# Altium project RpiNeoCore_Display.PrjPcb (part 1 of 3)
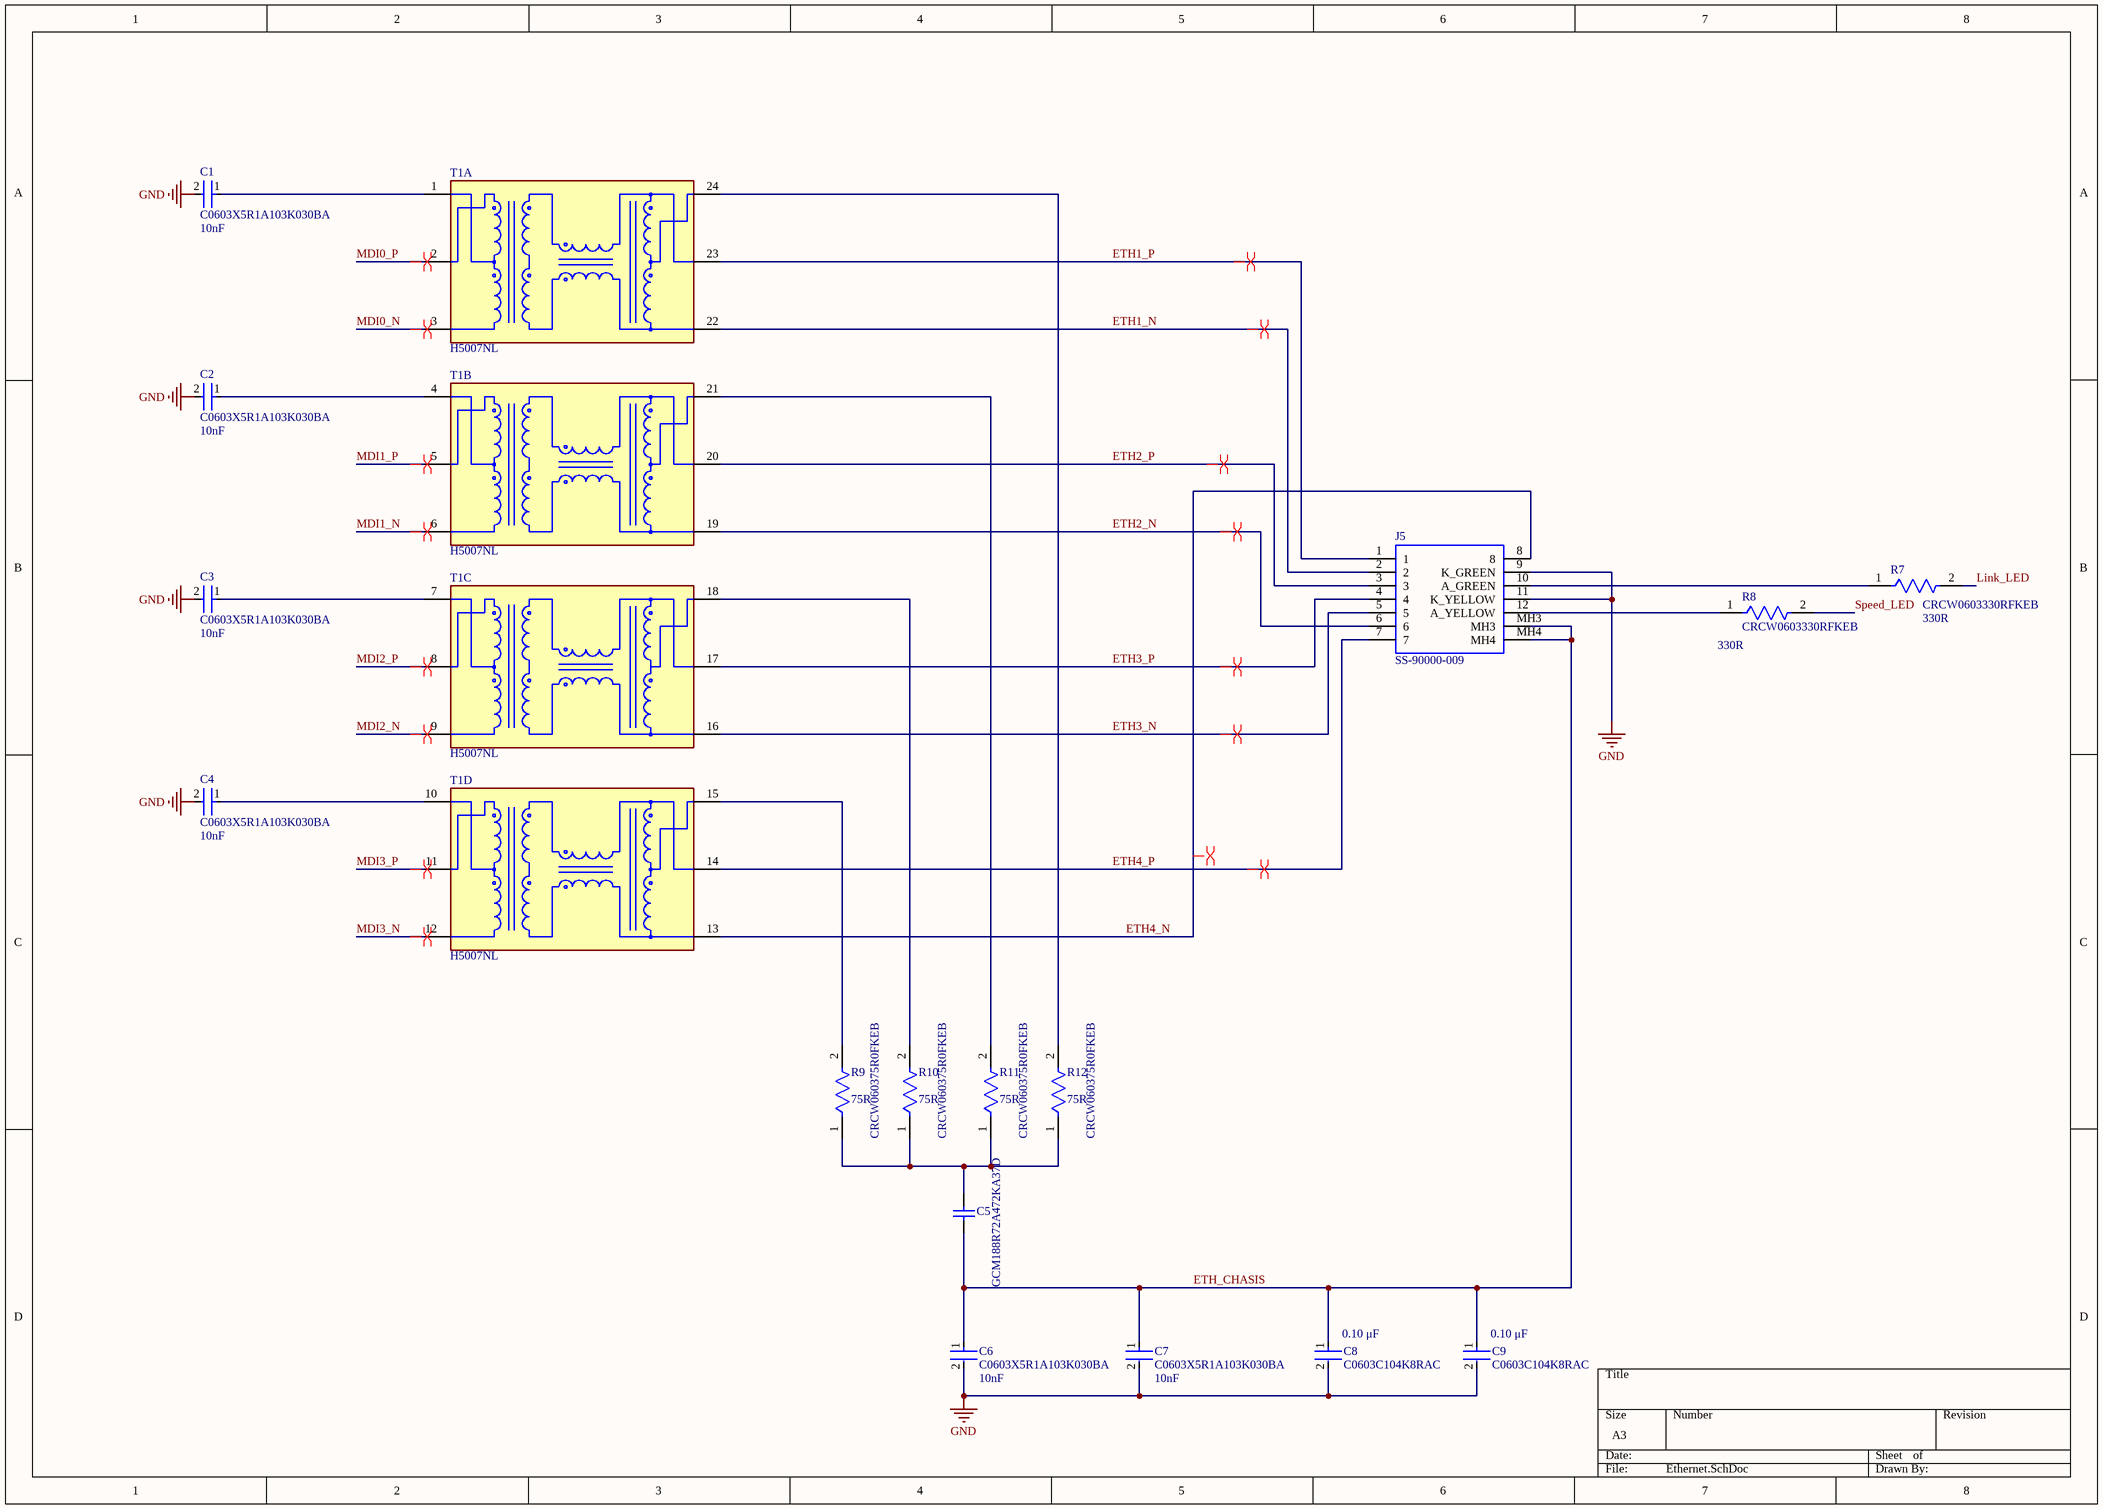
[diagram p0: Ethernet.SchDoc]
11 sheets, 210 parts. Net scope: global (net labels, ports and power ports of the same name join across sheets).
Board file: PCB1.PcbDoc
Sheets:
  Ethernet.SchDoc
  Sheet1.SchDoc
  Power.SchDoc
  DigitalInputs.SchDoc
  LED_DRIVER.SchDoc
  AlarmRelay.SchDoc
  AnalogInputs.SchDoc
  SerialCommunication.SchDoc
  SerialCommunication1.SchDoc
  SerialCommunication2.SchDoc
  CANBUS.SchDoc

## Sheet Ethernet.SchDoc
size A3; SheetNumber: 1; SheetTotal: 11

### Parts
C1  C0603X5R1A103K030BA  Capacitance: 10nF  [FP-C0603-030-0_03-MFG]
C2  C0603X5R1A103K030BA  Capacitance: 10nF  [FP-C0603-030-0_03-MFG]
C3  C0603X5R1A103K030BA  Capacitance: 10nF  [FP-C0603-030-0_03-MFG]
C4  C0603X5R1A103K030BA  Capacitance: 10nF  [FP-C0603-030-0_03-MFG]
C5  GCM188R72A472KA37D  [CAPC1608X90X35ML10T15]
C6  C0603X5R1A103K030BA  Capacitance: 10nF  [FP-C0603-030-0_03-MFG]
C7  C0603X5R1A103K030BA  Capacitance: 10nF  [FP-C0603-030-0_03-MFG]
C8  C0603C104K8RAC  Capacitance: 0.10 μF  [FP-C0603C-CF-MFG]
C9  C0603C104K8RAC  Capacitance: 0.10 μF  [FP-C0603C-CF-MFG]
J5  SS-90000-009  [SS90000009]
R7  CRCW0603330RFKEB  Resistance: 330R  [FP-CRCW0603-e3-IPC_A]
R8  CRCW0603330RFKEB  Resistance: 330R  [FP-CRCW0603-e3-IPC_A]
R9  CRCW060375R0FKEB  Resistance: 75R  [FP-CRCW0603-e3-IPC_B]
R10  CRCW060375R0FKEB  Resistance: 75R  [FP-CRCW0603-e3-IPC_B]
R11  CRCW060375R0FKEB  Resistance: 75R  [FP-CRCW0603-e3-IPC_B]
R12  CRCW060375R0FKEB  Resistance: 75R  [FP-CRCW0603-e3-IPC_B]
T1  H5007NL  [FP-H5007NL-MFG]  (parts A,B,C,D of 4)

### Nets
GND: C1.2 C2.2 C3.2 C4.2 C6.2 C7.2 C8.2 C9.2 J5.9(K_GREEN) J5.11(K_YELLOW)
ETH1_N: J5.2 T1.22(MX1-)
ETH1_P: J5.1 T1.23(MX1+)
ETH2_N: J5.6 T1.19(MX2-)
ETH2_P: J5.3 T1.20(MX2+)
ETH3_N: J5.5 T1.16(MX3-)
ETH3_P: J5.4 T1.17(MX3+)
ETH4_N: J5.8 T1.13(MX4-)
ETH4_P: J5.7 T1.14(MX4+)
ETH_CHASIS: C5.1 C6.1 C7.1 C8.1 C9.1 J5.MH3 J5.MH4
Link_LED: R7.2
MDI0_N: T1.3(TD1-)
MDI0_P: T1.2(TD1+)
MDI1_N: T1.6(TD2-)
MDI1_P: T1.5(TD2+)
MDI2_N: T1.9(TD3-)
MDI2_P: T1.8(TD3+)
MDI3_N: T1.12(TD4-)
MDI3_P: T1.11(TD4+)
Speed_LED: R8.2
NetC1_1: C1.1 T1.1(TCT1)
NetC2_1: C2.1 T1.4(TCT2)
NetC3_1: C3.1 T1.7(TCT3)
NetC4_1: C4.1 T1.10(TCT4)
NetC5_2: C5.2 R9.1 R10.1 R11.1 R12.1
NetJ5_10: J5.10(A_GREEN) R7.1
NetJ5_12: J5.12(A_YELLOW) R8.1
NetR9_2: R9.2 T1.15(MCT4)
NetR10_2: R10.2 T1.18(MCT3)
NetR11_2: R11.2 T1.21(MCT2)
NetR12_2: R12.2 T1.24(MCT1)

### Layout directives
differential pair: ETH1_N, ETH1_P, ETH2_N, ETH2_P, ETH3_N, ETH3_P, ETH4_N, ETH4_P, MDI0_N, MDI0_P, MDI1_N, MDI1_P, MDI2_N, MDI2_P, MDI3_N, MDI3_P

### Library data of the parts
C1-C4 C6 C7 = CMP-08246-002714-1: Multilayer Ceramic Capacitors 10nF ±10% 10V X5R SMD 0201; Dissipation Factor: 5%; Case Code (Imperial): 0201; Tolerance: 10%; Voltage: 10V; Case/Package: 0201; Width: 0.012inch; Series: C; Construction: Flat; Lead Free: Lead Free; Dielectric: X5R; Depth: 0.3mm; Mount: Surface Mount; Number of Pins: 2; Voltage Rating (DC): 10V; Radiation Hardening: No; Length: 0.6mm; Resistor Type: Ceramic; Dielectric Material: Ceramic; Packaging: Tape and Reel; Height: 0.3mm; Package Quantity: 1; RoHS Compliant: Yes; Thickness: 0.013inch; Min Operating Temperature: -55°C; Voltage Rating: 10V; Case Code (Metric): 0603; Weight: 6E-06oz; Max Operating Temperature: 85°C; Termination: SMD/SMT
C5 = CMP-2006-02966-1: Manufacturer: Murata; Part Number: GCM188R72A472KA37D
C8 C9 = CMP-03020-006081-2: C0603 0.10 μF X7R 30ppm/°C 10.00% 10 V; Manufacturer: KEMET; Value: 0.10 μF; Material: Ceramic; Automotive Grade: Grade 1; Voltage Rating: 10 V; Tolerance: 0.1; Automotive: Yes; Device Class L2: Capacitors; Height: 0.87mm; Temperature Range High: +125°C; Temperature Coefficient: 30ppm/°C; Temperature Range Low: -55°C; Package: C0603C-CF; Lead Free: Yes; Octopart: https://octopart.com/c0603c104k8rac-kemet-1325403; Manufacturer Part Number: C0603C104K8RAC; Temperature: -55°C to +125°C; Mouser Description: .1UF 10V 10% 0603; RoHS: TRUE; ComponentLink2URL: https://api.kemet.com/component-edge/download/datasheet/C0603C100J5GACAUTO.pdf; ComponentLink2Description: Datasheet; Temperature Characteristic: X7R; Device Class L1: Passive Components; Category: Cap; Device Class L3: Ceramic Capacitors
J5 = SS-90000-009: RJ45 8P8C Essential Jack; Manufacturer_Name: BelFuse; Geometry.Height: 13.38mm; Mouser Part Number: 530-SS-90000-009; Mouser Price/Stock: https://www.mouser.co.uk/ProductDetail/Stewart-Connector-Bel/SS-90000-009?qs=T%252BzbugeAwjge6q5Vl6EkRg%3D%3D; Manufacturer_Part_Number: SS-90000-009; Datasheet Link: https://www.belfuse.com/resources/drawings/stewartconnector/dr-STW-SS-90000-009.pdf
R7 R8 = CMP-2000-03240-2: RES Thick Film, 330Ω, 1%, 0.1W, 100ppm/°C, 0603; Voltage Rating (DC): 75V; Power Rating: 100mW; Case Code (Metric): 1608; Case/Package: 0603; Voltage Rating: 75V; Min Operating Temperature: -55°C; Tolerance: 1%; Temperature Coefficient: 100ppm/°C; Weight: 7.1E-05oz; Depth: 0.85mm; Package Quantity: 10000; Number of Terminations: 2; Width: 0.85mm; Radiation Hardening: No; Termination: SMD/SMT; Case Code (Imperial): 0603; Packaging: Tape and Reel; Lead Free: Lead Free; Max Power Dissipation: 100mW; Military Standard: Not; Height: 0.02inch; Max Operating Temperature: 155°C; Length: 1.55mm; Composition: Thick Film; Features: Automotive AEC-Q200; Contact Plating: Tin
R9-R12 = CMP-02407-007302-1: RES Thick Film, 75Ω, 1%, 0.1W, 100ppm/°C, 0603; Voltage Rating: 75V; Max Power Dissipation: 100mW; Min Operating Temperature: -55°C; Termination: SMD/SMT; Tolerance: 1%; Case Code (Metric): 1608; Width: 0.033inch; Package Quantity: 10000; Length: 0.061inch; Max Operating Temperature: 155°C; Height: 0.02inch; Number of Terminations: 2; Packaging: Tape and Reel; Case Code (Imperial): 0603; Features: Automotive AEC-Q200; Weight: 7.1E-05oz; Lead Free: Lead Free; Temperature Coefficient: 100ppm/°C; Composition: Thick Film; Power Rating: 100mW; Case/Package: 0603
T1 = CMP-2000-06385-2: MODULE SINGLE GIGABIT LAN 24SOIC; Isolation Voltage: 1.5kV; Insertion Loss: 1dB; Return Loss: -10dB; Turns Ratio: 1:1; Lead/Base Style: Gull Wing; Shielding: Unshielded; Packaging: Rail/Tube; Weight: 0.056438oz; Depth: 16mm; Mount: Surface Mount; Number of Pins: 24; Lead Free: Lead Free; Min Operating Temperature: 0°C; Length: 17.53mm; Package Quantity: 25; Case/Package: Module; Radiation Hardening: No; RoHS Compliant: Yes; Max Operating Temperature: 70°C; Series: -; Width: 12.2mm; Height: 5.51mm; Termination: SMD/SMT; Height - Seated (Max): 5.76mm

## Sheet Sheet1.SchDoc
size 381 x 241 mm; SheetNumber: 2; SheetTotal: 11
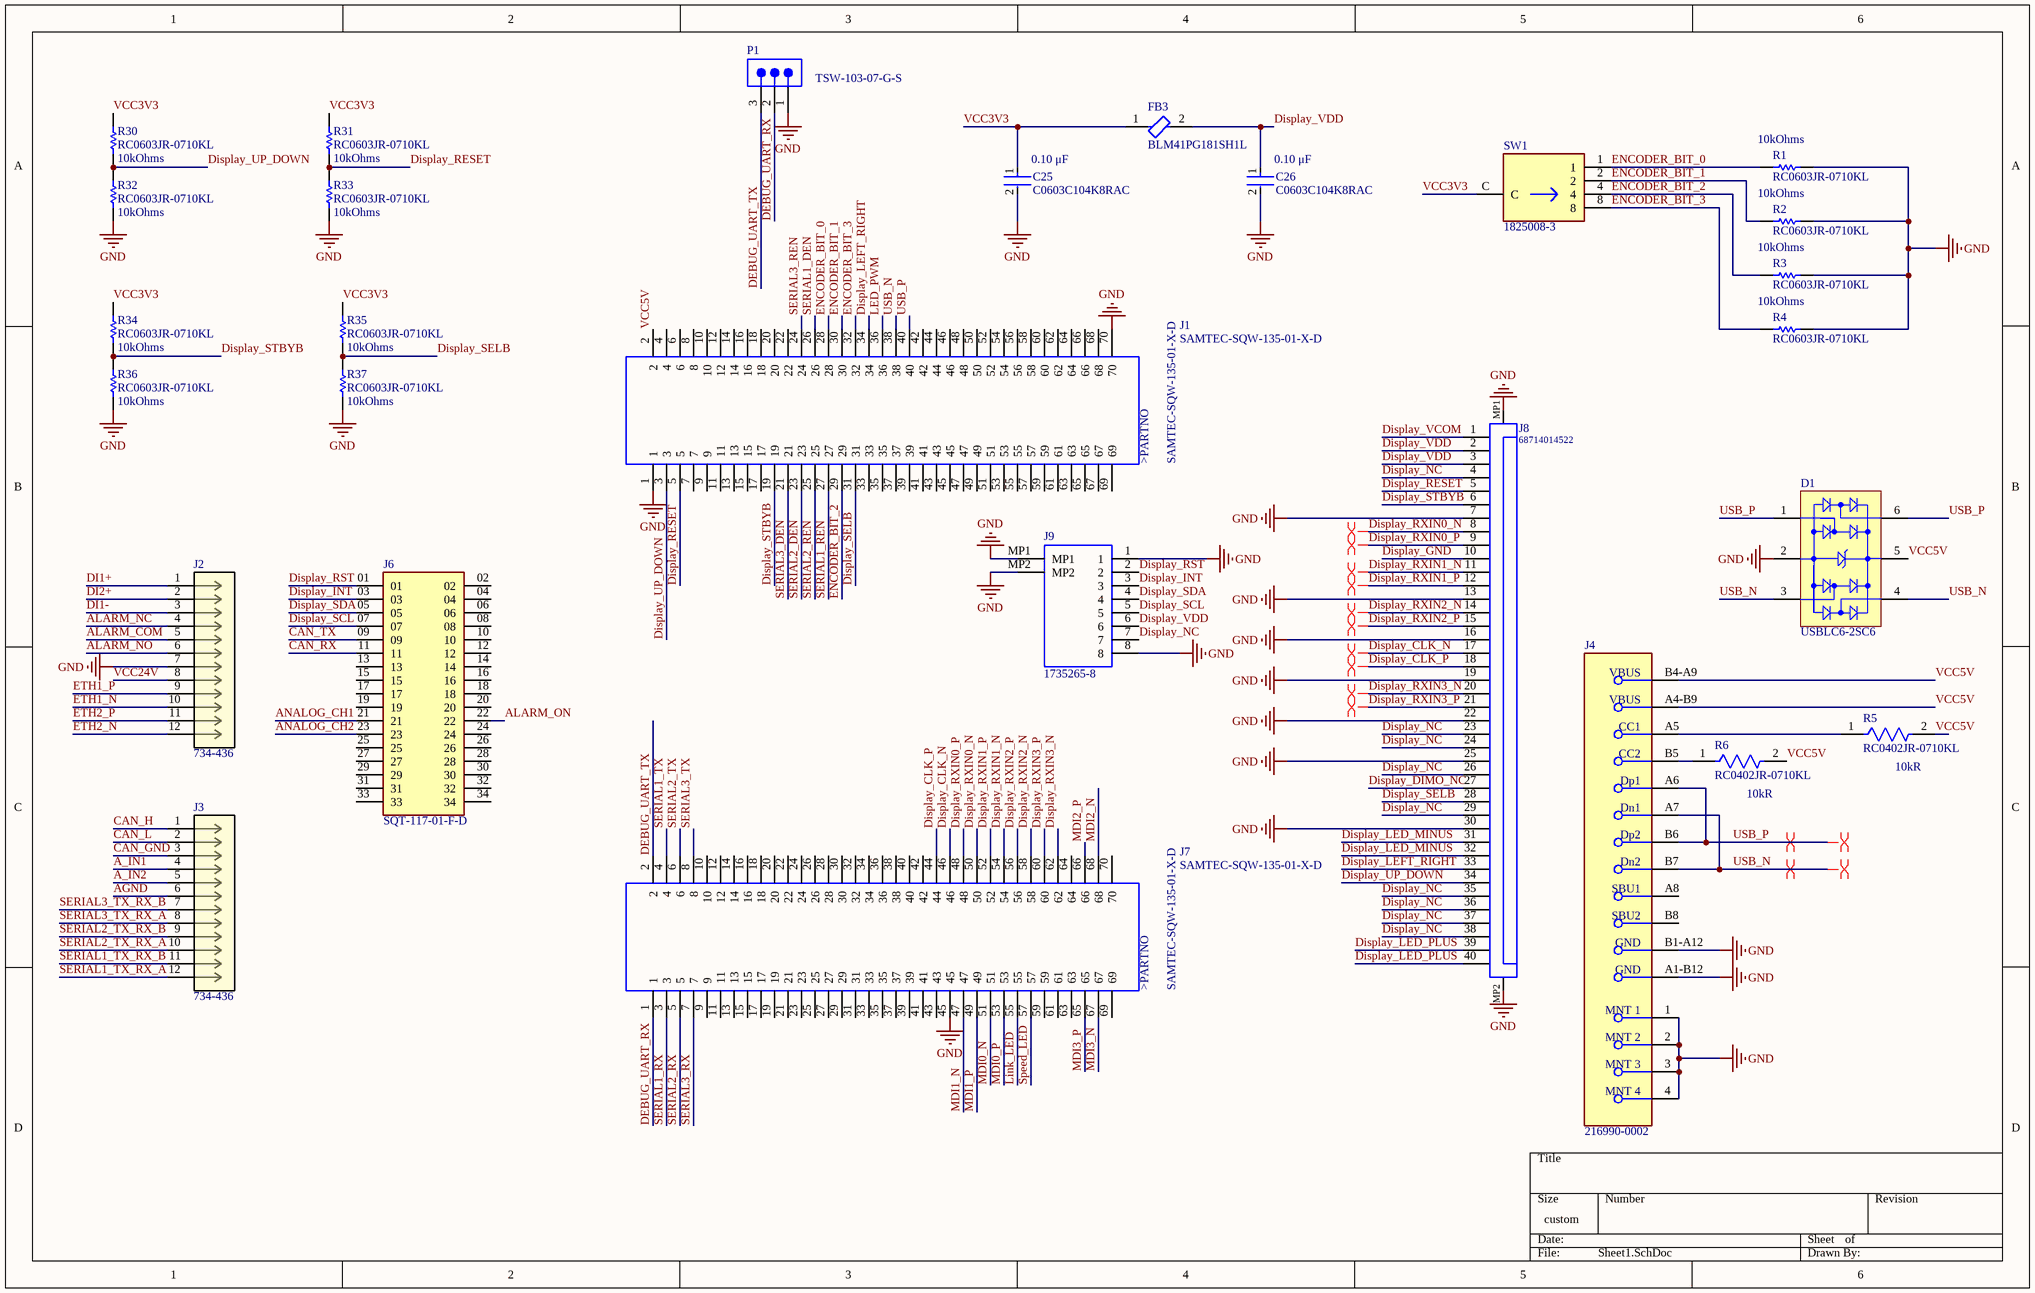
[diagram p1: Sheet1.SchDoc]

### Parts
C25  C0603C104K8RAC  Capacitance: 0.10 μF  [FP-C0603C-CF-MFG]
C26  C0603C104K8RAC  Capacitance: 0.10 μF  [FP-C0603C-CF-MFG]
D1  USBLC6-2SC6  [STM-SOT23-6L_V]
FB3  BLM41PG181SH1L  [FP-BLM41-0_2-a1_2-MFG]
J1  SAMTEC-SQW-135-01-X-D  [SAMTEC-SQW-135-01-X-D]
J2  734-436  [CONN12_734-436_WAG]
J3  734-436  [CONN12_734-436_WAG]
J4  216990-0002  [FP-216990-0002-MFG]
J6  SQT-117-01-F-D  [SAMTEC_SQT-117-01-F-D]
J7  SAMTEC-SQW-135-01-X-D  [SAMTEC-SQW-135-01-X-D]
J8  68714014522  [68714014522]
J9  1735265-8  [17352658]
P1  TSW-103-07-G-S  [SMTC-TSW-103-07-X-S]
R1  RC0603JR-0710KL  Resistance: 10kOhms  [RESC1608X55X25ML10T15]
R2  RC0603JR-0710KL  Resistance: 10kOhms  [RESC1608X55X25ML10T15]
R3  RC0603JR-0710KL  Resistance: 10kOhms  [RESC1608X55X25ML10T15]
R4  RC0603JR-0710KL  Resistance: 10kOhms  [RESC1608X55X25ML10T15]
R5  RC0402JR-0710KL  Resistance: 10kR  [FP-RC0402-0_4-IPC_C]
R6  RC0402JR-0710KL  Resistance: 10kR  [FP-RC0402-0_4-IPC_C]
R30  RC0603JR-0710KL  Resistance: 10kOhms  [RESC1608X55X25ML10T15]
R31  RC0603JR-0710KL  Resistance: 10kOhms  [RESC1608X55X25ML10T15]
R32  RC0603JR-0710KL  Resistance: 10kOhms  [RESC1608X55X25ML10T15]
R33  RC0603JR-0710KL  Resistance: 10kOhms  [RESC1608X55X25ML10T15]
R34  RC0603JR-0710KL  Resistance: 10kOhms  [RESC1608X55X25ML10T15]
R35  RC0603JR-0710KL  Resistance: 10kOhms  [RESC1608X55X25ML10T15]
R36  RC0603JR-0710KL  Resistance: 10kOhms  [RESC1608X55X25ML10T15]
R37  RC0603JR-0710KL  Resistance: 10kOhms  [RESC1608X55X25ML10T15]
SW1  1825008-3  [FP-1825008-3-MFG]

### Nets
GND: C25.2 C26.2 D1.2(GND) J1.1 J1.70 J2.7 J4.1(MNT_1) J4.2(MNT_2) J4.3(MNT_3) J4.4(MNT_4) J4.A1-B12(GND) J4.B1-A12(GND) J7.45 J8.7 J8.13 J8.16 J8.19 J8.22 J8.25 J8.30 J8.MP1 J8.MP2 J9.1 J9.8 J9.MP1 J9.MP2 P1.1 R1.2 R2.2 R3.2 R4.2 R32.1 R33.1 R36.1 R37.1
A_IN1: J3.4
A_IN2: J3.5
AGND: J3.6
ALARM_COM: J2.5
ALARM_NC: J2.4
ALARM_NO: J2.6
ALARM_ON: J6.22
ANALOG_CH1: J6.21
ANALOG_CH2: J6.23
CAN_GND: J3.3
CAN_H: J3.1
CAN_L: J3.2
CAN_RX: J6.11
CAN_TX: J6.09
DEBUG_UART_RX: J7.1 P1.2
DEBUG_UART_TX: J7.2 P1.3
DI1+: J2.1
DI1-: J2.3
DI2+: J2.2
Display_CLK_N: J7.46 J8.17
Display_CLK_P: J7.44 J8.18
Display_DIMO_NC: J8.27
Display_GND: J8.10
Display_INT: J6.03 J9.3
Display_LED_MINUS: J8.31 J8.32
Display_LED_PLUS: J8.39 J8.40
Display_LEFT_RIGHT: J1.34 J8.33
Display_NC: J8.4 J8.23 J8.24 J8.26 J8.29 J8.35 J8.36 J8.37 J8.38 J9.7
Display_RESET: J1.5 J8.5 R31.1 R33.2
Display_RST: J6.01 J9.2
Display_RXIN0_N: J7.50 J8.8
Display_RXIN0_P: J7.48 J8.9
Display_RXIN1_N: J7.54 J8.11
Display_RXIN1_P: J7.52 J8.12
Display_RXIN2_N: J7.58 J8.14
Display_RXIN2_P: J7.56 J8.15
Display_RXIN3_N: J7.62 J8.20
Display_RXIN3_P: J7.60 J8.21
Display_SCL: J6.07 J9.5
Display_SDA: J6.05 J9.4
Display_SELB: J1.31 J8.28 R35.1 R37.2
Display_STBYB: J1.19 J8.6 R34.1 R36.2
Display_UP_DOWN: J1.3 J8.34 R30.1 R32.2
Display_VCOM: J8.1
Display_VDD: C26.1 FB3.2 J8.2 J8.3 J9.6
ENCODER_BIT_0: J1.28 R1.1 SW1.1
ENCODER_BIT_1: J1.30 R2.1 SW1.2
ENCODER_BIT_2: J1.29 R3.1 SW1.4
ENCODER_BIT_3: J1.32 R4.1 SW1.8
ETH1_N: J2.10
ETH1_P: J2.9
ETH2_N: J2.12
ETH2_P: J2.11
LED_PWM: J1.36
Link_LED: J7.55
MDI0_N: J7.51
MDI0_P: J7.53
MDI1_N: J7.47
MDI1_P: J7.49
MDI2_N: J7.68
MDI2_P: J7.66
MDI3_N: J7.67
MDI3_P: J7.65
SERIAL1_DEN: J1.26
SERIAL1_REN: J1.27
SERIAL1_RX: J7.3
SERIAL1_TX: J7.4
SERIAL1_TX_RX_A: J3.12
SERIAL1_TX_RX_B: J3.11
SERIAL2_DEN: J1.23
SERIAL2_REN: J1.25
SERIAL2_RX: J7.5
SERIAL2_TX: J7.6
SERIAL2_TX_RX_A: J3.10
SERIAL2_TX_RX_B: J3.9
SERIAL3_DEN: J1.21
SERIAL3_REN: J1.24
SERIAL3_RX: J7.7
SERIAL3_TX: J7.8
SERIAL3_TX_RX_A: J3.8
SERIAL3_TX_RX_B: J3.7
Speed_LED: J7.57
USB_N: D1.3(I/O_2) D1.4(I/O_3) J1.38 J4.A7(Dn1) J4.B7(Dn2)
USB_P: D1.1(I/O_1) D1.6(I/O_4) J1.40 J4.A6(Dp1) J4.B6(Dp2)
VCC3V3: C25.1 FB3.1 R30.2 R31.2 R34.2 R35.2 SW1.C
VCC5V: D1.5(VBUS) J1.2 J4.A4-B9(VBUS) J4.B4-A9(VBUS) R5.2 R6.2
VCC24V: J2.8
NetJ4_A5: J4.A5(CC1) R5.1
NetJ4_B5: J4.B5(CC2) R6.1

Not connected (* = marked no-connect by the designer): J1 4 6 7 8 9 10 11 12 13 14 15 16 17 18 20 22 33 35 37 39 41 42 43 44 45 46 47 48 49 50 51 52 53 54 55 56 57 58 59 60 61 62 63 64 65 66 67 68 69; J4 A8(SBU1) B8(SBU2); J6 02 04 06 08 10 12 13 14 15 16 17 18 19 20 24 25 26 27 28 29 30 31 32 33 34; J7 9 10 11 12 13 14 15 16 17 18 19 20 21 22 23 24 25 26 27 28 29 30 31 32 33 34 35 36 37 38 39 40 41 42 43 59 61 63 64 69 70

### Layout directives
differential pair: Display_CLK_N, Display_CLK_P, Display_RXIN0_N, Display_RXIN0_P, Display_RXIN1_N, Display_RXIN1_P, Display_RXIN2_N, Display_RXIN2_P, Display_RXIN3_N, Display_RXIN3_P, USB_N, USB_P
net class diff90: USB_N, USB_P
net class diff120: Display_CLK_N, Display_CLK_P, Display_RXIN0_N, Display_RXIN0_P, Display_RXIN1_N, Display_RXIN1_P, Display_RXIN2_N, Display_RXIN2_P, Display_RXIN3_N, Display_RXIN3_P

### Notes on the sheet
- (in symbol SAMTEC-SQW-135-01-X-D) >PARTNO

### Library data of the parts
C25 C26 = CMP-03020-006081-2: as C8 on sheet Ethernet; Automotive: Yes; Device Class L2: Capacitors; Height: 0.87mm; Temperature Range High: +125°C; Temperature Coefficient: 30ppm/°C; Temperature Range Low: -55°C; Package: C0603C-CF; Lead Free: Yes; Octopart: https://octopart.com/c0603c104k8rac-kemet-1325403; Manufacturer Part Number: C0603C104K8RAC; Temperature: -55°C to +125°C; Mouser Description: .1UF 10V 10% 0603; RoHS: TRUE; ComponentLink2URL: https://api.kemet.com/component-edge/download/datasheet/C0603C100J5GACAUTO.pdf; ComponentLink2Description: Datasheet; Temperature Characteristic: X7R; Device Class L1: Passive Components; Category: Cap; Device Class L3: Ceramic Capacitors
D1 = CMP-2000-05378-1: Very low capacitance ESD protection, 3.5 pF, -40 to 125 degC, 6-Pin SOT23, RoHS, Tape and Reel; Manufacturer: STMicroelectronics; Polarity: Uni-Directional; Clamping Voltage: 17V; Rad Hardened: No; Product Height (mm): 1.3mm; Leakage Current (Max): 0.15uA; Product Length (mm): 3.05mm; Number of Elements: 1; Peak Pulse Current: 5A; Configuration: Dual; Reverse Breakdown Voltage: 6V; Working Voltage (Max): 5V; Capacitance Value: 3.5pF; Suppressor Type: DiodeArrays; Product Depth (mm): 1.75mm; Test Current (It): 1mA; Package / Case: SOT-23; Operating Temperature Max Deg. C: 125C; Package Description: 6-Pin Small Outline Transistor, Body 2.925 x 1.625 mm, Pitch 0.95 mm; Package Reference: SOT23-6L; Datasheet Version: Rev. 5, 10/2011; Operating Temperature Min Deg. C: -40C; Mounting Style: SurfaceMount; Direction Type: Uni-Directional; Mounting: SurfaceMount; Pin Count: 6; Leakage Current: 0.15uA; Packaging: TapeandReel; Operating Temperature Classification: Automotive; Clamping Voltage (Max): 17V; Manufacturer URL: http://www.st.com/; Reverse Stand-off Voltage: 5V; Datasheet URL: http://www.st.com/st-web-ui/static/active/en/resource/technical/document/datasheet/CD00050750.pdf; Working Voltage: 5V; Operating Temp Range: -40Cto125C
FB3 = CMP-06046-002023-1: Ferrite Bead, 1806, 180Ω @ 100MHz, 25%, 0.02Ω, 3.5A; Impedance: 180R; Number of Lines: 1; Max DC Current: 50mA; DC Resistance (DCR): 20mR; Mount: Surface Mount; Length: 4.5mm; Tolerance: 25%; Series: EMIFIL®, BLM41P; Package Quantity: 2500; Min Operating Temperature: -55°C; Max Operating Temperature: 125°C; Height: 0.071inch; Packaging: Tape and Reel; Contact Plating: Tin; Test Frequency: 100MHz; Ratings: AEC-Q200; Case Code (Metric): 4516; Termination: SMD/SMT; Case Code (Imperial): 1806; Width: 0.063inch; Max Current Rating: 3.5A; Case/Package: 1806
J2 J3 = 734-436: No Description Available; Mfr_Name: Wago; Copyright: Copyright (C) 2022 Ultra Librarian. All rights reserved.; Manufacturer_Part_Number: 734-436; RefDes: RefDes; Type: DEV
J4 = CMP-04767-000018-1: CONN RCP USB2.0 TYP C 24P SMD RA
J6 = SQT-117-01-F-D: MF: Samtec; Package: None; Value: *; Price: None; MP: SQT-117-01-F-D; Availability: Unavailable
J8 = CMP-1502-01545-1: SMT ZIF Connectors WR-FPC, Horizontal, Bottom Contact, pitch 0.5 mm, 40 pins; Manufacturer: Wurth Elektronik; Pitch: 0.5mm; Contact Resistance: 20mOhm; Working Voltage: 50VAC; Rated Current: 0.5A; Withstanding Voltage: 250VAC; Pin Number: 40; Part Number: 68714014522; Package Reference: 68714014522; Manufacturer URL: http://www.we-online.de; Operating Temperature: -25to85degC; Publisher: WurthElektronik; Datasheet URL: https://katalog.we-online.de/em/datasheet/68714014522.pdf; Packaging: TapeandReel; Contact Design: BottomContact; Orientation: Horizontal; Mounting Technology: SMT
J9 = 1735265-8: 1MM FPC HORZ.BOTTOM CONT.ASSY 8P (Au); Manufacturer_Name: TE Connectivity; Geometry.Height: 2.74mm; Mouser Part Number: 571-1735265-8; Mouser Price/Stock: https://www.mouser.co.uk/ProductDetail/TE-Connectivity-AMP/1735265-8?qs=vkMqrgFpRajjm%252BbPDw7SSA%3D%3D; Manufacturer_Part_Number: 1735265-8; Datasheet Link: https://www.te.com/commerce/DocumentDelivery/DDEController?Action=showdoc&DocId=Customer+Drawing%7F1735265%7FB%7Ftif%7FEnglish%7FENG_CD_1735265_B.tif%7F1735265-8
P1 = CMP-1024-00333-1: 0.025" SQ Post Header, Through-hole, Vertical, -55 to 125 degC, 2.54 mm Pitch, 3-Pin, Male, RoHS; Manufacturer: Samtec; Pitch: 2.54 mm; ComponentLink3URL: http://www.samtec.com/documents/webfiles/cpdf/TSW-XXX-XX-XXX-X-XX-XXX-MKT.pdf; Temperature Range: -55 to 125 degC; DatasheetVersion: F-214; ComponentLink1Description: Manufacturer URL; ComponentLink2URL: http://www.samtec.com/documents/webfiles/pdf/TSW_TH.PDF; RoHS: True; Orientation: Vertical; ComponentLink2Description: Datasheet; ComponentLink3Description: Package Specification; PackageDescription: .025[0.64] SQ. Post Terminal Strip Assembly; Mounting Technology: Through-hole; PackageVersion: DM, 8/1988; ComponentLink1URL: http://www.samtec.com; PackageReference: TSW-103-07-X-S; PartNumber: TSW-103-07-G-S
R1-R4 R30-R37 = CMP-2000-05022-1: Resistor, 10 KOhm, +/- 5%, 100 mW, -55 to 155 degC, 0603 (1608 Metric), RoHS, Tape and Reel; Manufacturer: Yageo; Voltage Rating: 50V; Temperature Coefficient: 100PPM/C; Power Rating: 100mW; Package Reference: 603; Series: RC; Case Code - mm: 1608; Packaging: Reel; Datasheet URL: http://www.farnell.com/datasheets/443971.pdf; Datasheet Version: Rev. 4, 04/2009; Operating Temperature Range: -55Cto+155C; Product: ThickFilmResistorsGeneralPurpose; Package Description: 2-Pin Surface Mount Device, Body 1.6 x 0.8 mm; Manufacturer URL: http://www.yageo.com/; Case Code - in: 0603; Tolerance: 5%; Termination Style: SMD/SMT
R5 R6 = CMP-2002-07915-3: RES 10K OHM 5% 1/16W 0402; Max Power Dissipation: 63mW; Temperature Coefficient: 100ppm/°C; Power Rating: 62.5mW; Voltage Rating: 50V; Size Code: 0402; Resistance Tolerance: 5%; Packaging: Tape and Reel; Case Code (Metric): 1005; Lead Free: Lead Free; Resistor Type: Thick Film; Min Operating Temperature: -55°C; Military Standard: Not; Depth: 0.5mm; Series: RC; Case/Package: 0402; Construction: Rectangular; Number of Terminations: 2; Package Quantity: 1; Termination: SMD/SMT; Length: 0.039inch; Case Code (Imperial): 0402; Height: 0.016inch; Features: Moisture Resistant; RoHS Compliant: Yes; Max Operating Temperature: 155°C; Tolerance: 5%; Width: 0.02inch
SW1 = CMP-03404-000004-1: SW ROTARY DIP HEX COMP 0.4VA 20V; Sealable: No (Without); Washable: Yes; Number of Positions: 16; Illumination Type: Illuminated; Pitch: 2.54mm; Throw Configuration: SP16T; Series: DRD, Alcoswitch; Voltage Rating (AC): 20V; Housing Material: Thermoplastic; Max Operating Temperature: 85°C; Contact Plating: Gold; ELV: Compliant; Package Quantity: 45; Flammability Rating: UL94 V-0; Radiation Hardening: No; Voltage Rating (DC): 20V; Contact Material: Copper Alloy; Packaging: Rail/Tube; Depth: 12mm; Min Operating Temperature: -30°C; Max Voltage Rating (AC): 20V; Housing Color: Black; Length: 10mm; Mount: Through Hole; Lead Free: Lead Free; Actuator Type: Rotary; RoHS Compliant: Yes; Type: Switch; Max Voltage Rating (DC): 20V; Orientation: Right Angle; Termination: PC Pins
J1 J7 = SAMTEC-SQW-135-01-X-D: Package: None; Price: None; Value: *; MP: SAMTEC-SQW-135-01-X-D; Availability: Unavailable

## Sheet Power.SchDoc
size A3; SheetNumber: 3; SheetTotal: 11
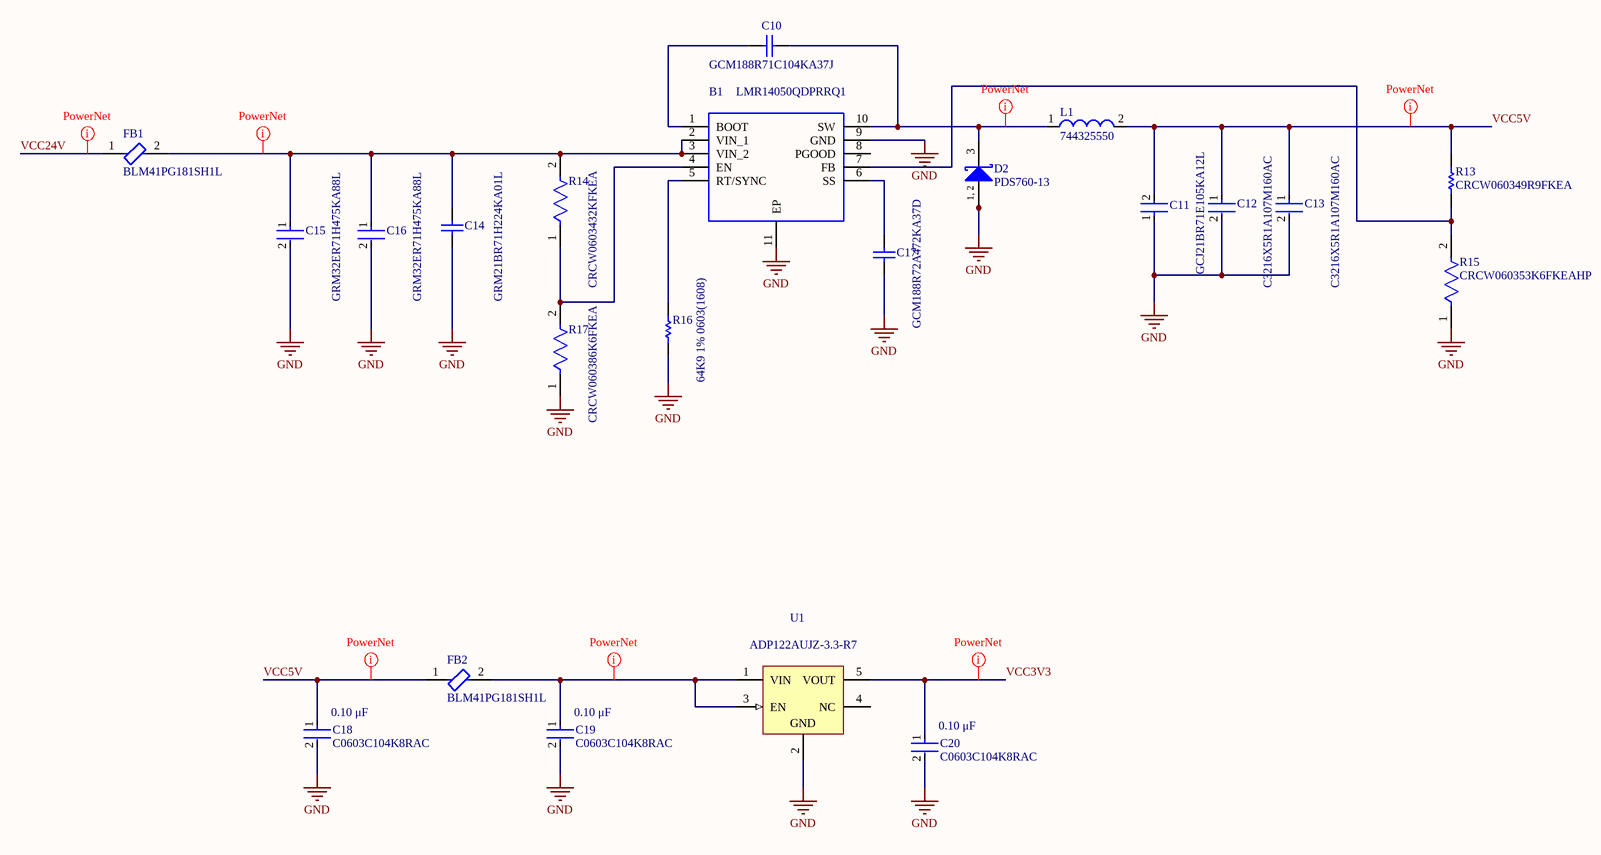
[diagram p2: Power.SchDoc]

### Parts
B1  LMR14050QDPRRQ1  [SON80P400X400X80-11N]
C10  GCM188R71C104KA37J  [CAPC1608X90X35LL10T15]
C11  GCJ21BR71E105KA12L  [FP-GCJ21B-0_3-MFG]
C12  C3216X5R1A107M160AC  [FP-C3216-160-0_3-IPC_C]
C13  C3216X5R1A107M160AC  [FP-C3216-160-0_3-IPC_C]
C14  GRM21BR71H224KA01L  [CAPC2013X135X45NL10T25]
C15  GRM32ER71H475KA88L  [FP-GRM32-MFG]
C16  GRM32ER71H475KA88L  [FP-GRM32-MFG]
C17  GCM188R72A472KA37D  [CAPC1608X90X35ML10T15]
C18  C0603C104K8RAC  Capacitance: 0.10 μF  [FP-C0603C-CF-MFG]
C19  C0603C104K8RAC  Capacitance: 0.10 μF  [FP-C0603C-CF-MFG]
C20  C0603C104K8RAC  Capacitance: 0.10 μF  [FP-C0603C-CF-MFG]
D2  PDS760-13  [DIOD-POWERDI5-3_V]
FB1  BLM41PG181SH1L  [FP-BLM41-0_2-a1_2-MFG]
FB2  BLM41PG181SH1L  [FP-BLM41-0_2-a1_2-MFG]
L1  744325550  [WE-HCI-1050]
R13  CRCW060349R9FKEA  [RESC1609X50X30ML10T20]
R14  CRCW0603432KFKEA  [FP-CRCW0603-e3-MFG]
R15  CRCW060353K6FKEAHP  [FP-CRCW0603-HPe3-MFG]
R16  64K9 1% 0603(1608)  [RESC0603(1608)_N]
R17  CRCW060386K6FKEA  [FP-CRCW0603-e3-IPC_B]
U1  ADP122AUJZ-3.3-R7  [ADI-UJ-5_M]

### Nets
GND: B1.9(GND) B1.11(EP) C11.1 C12.2 C13.2 C14.1 C15.2 C16.2 C17.1 C18.2 C19.2 C20.2 D2.1(A) D2.2(A) R15.1 R16.1 R17.1 U1.2(GND)
VCC3V3: C20.1 U1.5(VOUT)
VCC5V: C11.2 C12.1 C13.1 C18.1 FB2.1 L1.2 R13.2
VCC24V: FB1.1
NetB1_1: B1.1(BOOT) C10.1
NetB1_2: B1.2(VIN_1) B1.3(VIN_2) C14.2 C15.1 C16.1 FB1.2 R14.2
NetB1_4: B1.4(EN) R14.1 R17.2
NetB1_5: B1.5(RT/SYNC) R16.2
NetB1_6: B1.6(SS) C17.2
NetB1_7: B1.7(FB) R13.1 R15.2
NetB1_10: B1.10(SW) C10.2 D2.3(K) L1.1
NetC19_1: C19.1 FB2.2 U1.1(VIN) U1.3(EN)

Not connected (* = marked no-connect by the designer): B1 8(PGOOD); U1 4(NC)

### Layout directives
net class Power: NetB1_2, NetB1_10, NetC19_1, VCC3V3, VCC5V, VCC24V

### Notes on the sheet
- (in symbol CMP-2000-07476-1) 1, 2

### Library data of the parts
B1 = LMR14050QDPRRQ1: Automotive 40V, 5A SIMPLE SWITCHER&#174;, 2.2MHz Step-Down Regulator with 40uA IQ; Manufacturer_Name: Texas Instruments; Geometry.Height: 0.8mm; Mouser Part Number: 595-LMR14050QDPRRQ1; Mouser Price/Stock: https://www.mouser.co.uk/ProductDetail/Texas-Instruments/LMR14050QDPRRQ1?qs=osPbIpHqQ9V%2F1b1tDugQKw%3D%3D; Manufacturer_Part_Number: LMR14050QDPRRQ1; Datasheet Link: http://www.ti.com/lit/gpn/lmr14050-q1
C10 = CMP-2006-02356-1: Manufacturer: Murata; Part Number: GCM188R71C104KA37J
C11 = CMP-2007-03211-2: Multilayer Ceramic Capacitors MLCC - SMD/SMT 0805 1uF 10%, 25VDC,  X7R 15%; Voltage Rating (DC): 25V; Package Quantity: 3000; Depth: 1.25mm; Packaging: Tape and Reel; Voltage Rating: 25V; Max Operating Temperature: 125°C; Ratings: AEC-Q200; Width: 1.25mm; Min Operating Temperature: -55°C; Termination: SMD/SMT; Lead Free: Lead Free; Dielectric: X7R; Length: 2mm; Thickness: 0.057inch; Capacitance: 1uF; Tolerance: 10%; Case Code (Metric): 2012; Case/Package: 0805; Mount: Surface Mount; Features: Soft Termination; Case Code (Imperial): 0805
C12 C13 = CMP-2000-05396-3: Multilayer Ceramic Capacitors 100uF ±20% 10V X5R SMD 1206; Voltage Rating (DC): 10V; Length: 3.2mm; Mount: Surface Mount; Depth: 1.6mm; Width: 1.6mm; Package Quantity: 1; Min Operating Temperature: -55°C; Packaging: Tape and Reel; Max Operating Temperature: 85°C; Dielectric: X5R; Construction: Flat; Case Code (Imperial): 1206; Capacitance: 100uF; Thickness: 0.075inch; Radiation Hardening: No; RoHS Compliant: Yes; Series: C; Dielectric Material: Ceramic; Voltage: 10V; REACH SVHC: No SVHC; Case Code (Metric): 3216; Weight: 0.000571oz; Height: 1.6mm; Voltage Rating: 10V; Termination: SMD/SMT; Lead Free: Lead Free; Tolerance: 20%; Case/Package: 1206; Resistor Type: Ceramic
C14 = CMP-2007-03583-1: Manufacturer: Murata; Part Number: GRM21BR71H224KA01L
C15 C16 = CMP-1038-02162-3: CAP CER 4.7UF 50V X7R 1210; Manufacturer: Murata; Tolerance: 10%; Temperature Coefficient: 15%; Material: Ceramic; Lead Free: Yes; Value: 4.7uF; ComponentLink2Description: Datasheet; Capacitance: 4.7uF; Digikey Description: CAP CER 4.7UF 50V X7R 1210; Category: Cap; Automotive: No; ComponentLink2URL: https://search.murata.co.jp/Ceramy/image/img/A01X/G101/ENG/GRM32ER71H475KA88-01A.pdf; Package: GRM32; Device Class L2: Capacitors; Voltage Rating: 50V; Device Class L1: Passive Components; Mouser Description: Capacitor Capacitance tolerance: ±10% Ceramic type: X7R Construction form: 1210 Capacitance: 4.7 µF Rated voltage: 50...; Octopart: https://octopart.com/grm32er71h475ka88l-murata-196576; Temperature: -55°C to +125°C; Temperature Range Low: -55°C; Height: 2.7mm; Manufacturer Part Number: GRM32ER71H475KA88L; Temperature Characteristic: X7R; Temperature Range High: +125°C; RoHS: TRUE; Device Class L3: Ceramic Capacitors
C17 = CMP-2006-02966-1: Manufacturer: Murata; Part Number: GCM188R72A472KA37D
C18-C20 = CMP-03020-006081-2: as C8 on sheet Ethernet; Automotive: Yes; Device Class L2: Capacitors; Height: 0.87mm; Temperature Range High: +125°C; Temperature Coefficient: 30ppm/°C; Temperature Range Low: -55°C; Package: C0603C-CF; Lead Free: Yes; Octopart: https://octopart.com/c0603c104k8rac-kemet-1325403; Manufacturer Part Number: C0603C104K8RAC; Temperature: -55°C to +125°C; Mouser Description: .1UF 10V 10% 0603; RoHS: TRUE; ComponentLink2URL: https://api.kemet.com/component-edge/download/datasheet/C0603C100J5GACAUTO.pdf; ComponentLink2Description: Datasheet; Temperature Characteristic: X7R; Device Class L1: Passive Components; Category: Cap; Device Class L3: Ceramic Capacitors
D2 = CMP-2000-07476-1: Schottky Barrier Rectifier, 60 V, 7 A, -65 to 150 degC, 3-Pin SMD, RoHS, Tape and Reel; Manufacturer: Diodes Inc; Max Repetitive Reverse Voltage (Vrrm): 60V; Element Configuration: CommonAnode; Max Forward Surge Current (Ifsm): 275A; Polarity: Standard; Forward Voltage: 620mV; Forward Current: 7A; Peak Reverse Current: 200uA; Case\/Package: SMD/SMT; Manufacturer URL: http://www.diodes.com/; Reverse Voltage (DC): 60V; Lead Free: LeadFree; Voltage Rating (DC): 60V; Min Operating Temperature: -65degC; Package Description: 3-Pin Surface Mount Device, Body 3.975 x 5.375 mm, Pitch 1.84 mm; Length: 4.05mm; Datasheet URL: https://www.diodes.com/assets/Datasheets/ds30477.pdf; REACH SVHC: NoSVHC; Peak Non-Repetitive Surge Current: 275A; Output Current: 7A; Contact Plating: Matte; Mounting Technology: SurfaceMount; Mount: SurfaceMount; RoHSCompliant: true; Weight: 0.003386oz; Current Rating: 7A; Max Operating Temperature: 150degC; Package Quantity: 5000; Height: 1.15mm; Average Rectified Current: 7A; Datasheet Version: Rev. 13-2, 10/2012; Number of Pins: 5; Width: 5.45mm; Packaging: TapeandReel; Radiation Hardening: No; Package Reference: POWERDI5-3
FB1 FB2 = CMP-06046-002023-1: as FB3 on sheet Sheet1; Mount: Surface Mount; Length: 4.5mm; Tolerance: 25%; Series: EMIFIL®, BLM41P; Package Quantity: 2500; Min Operating Temperature: -55°C; Max Operating Temperature: 125°C; Height: 0.071inch; Packaging: Tape and Reel; Contact Plating: Tin; Test Frequency: 100MHz; Ratings: AEC-Q200; Case Code (Metric): 4516; Termination: SMD/SMT; Case Code (Imperial): 1806; Width: 0.063inch; Max Current Rating: 3.5A; Case/Package: 1806
L1 = CMP-0226-00138-1: SMD Flat Wire High Current Inductor WE-HCI, L=5.50 µH; Inductance: 5.50 ÂµH; PackageDescription: SMD Inductor, 2-Leads, Body 10.5 x 10.2 mm; DatasheetVersion: ver 2, Jan-2008; ComponentLink2Description: Datasheet; PackageVersion: 2008; ComponentLink1Description: Manufacturer Link; PackageReference: WE-HCI-1050; ComponentLink1URL: http://www.we-online.com; ComponentLink2URL: http://www.we-online.de/katalog/media/pdf/744325550.pdf
R13 = CMP-1012-00363-2: Manufacturer: Vishay Dale; Part Number: CRCW060349R9FKEA
R14 = CMP-2000-03350-2: RES Thick Film, 432kΩ, 1%, 0.1W, 100ppm/°C, 0603; Voltage Rating: 75V; Max Power Dissipation: 100mW; Resistance: 432kR; Composition: Thick Film; Package Quantity: 10; Military Standard: Not; Number of Terminations: 2; Width: 0.033inch; Lead Free: Lead Free; Height: 0.02inch; Temperature Coefficient: 100ppm/°C; Min Operating Temperature: -55°C; Length: 1.55mm; Voltage Rating (DC): 75V; Termination: SMD/SMT; Max Operating Temperature: 155°C; Case Code (Imperial): 0603; Radiation Hardening: No; Case/Package: 0603; Packaging: Tape and Reel; Features: Automotive AEC-Q200; Case Code (Metric): 1608; Tolerance: 1%; Number of Pins: 2; Contact Plating: Tin; Weight: 7.1E-05oz; Depth: 0.85mm; Power Rating: 100mW
R15 = CMP-02407-004880-1: RES Thick Film, 53.6kΩ, 1%, 0.33W, 100ppm/°C, 0603; Max Power Dissipation: 250mW; Resistance: 53.6kR; Width: 0.033inch; Max Operating Temperature: 155°C; Case/Package: 0603; Height: 0.022inch; Temperature Coefficient: 100ppm/°C; Number of Terminations: 2; Features: Automotive AEC-Q200; Min Operating Temperature: -55°C; Contact Plating: Tin; Radiation Hardening: No; Composition: Thick Film; Length: 0.063inch; Package Quantity: 5000; Lead Free: Lead Free; Packaging: Tape and Reel; Tolerance: 1%
R16 = CMP-1012-00715-1: 64K9 0.1W 1% 0603 (1608 Metric)  SMD; Value: 64900.00 Ohm; Case-EIA: 0603; Case-Metric: 1608; Technology: SMT; Tolerance: 1 %; Power: 0.1 W
R17 = CMP-2000-03614-2: RES Thick Film, 86.6kΩ, 1%, 0.1W, 100ppm/°C, 0603; Max Power Dissipation: 100mW; Voltage Rating (DC): 75V; Resistance: 86.6kR; Features: Automotive AEC-Q200; Number of Pins: 2; Min Operating Temperature: -55°C; Series: CRCW; Tolerance: 1%; Temperature Coefficient: 100ppm/°C; Max Operating Temperature: 155°C; Package Quantity: 10; Case/Package: 0603; Resistor Type: Thick Film; Case Code (Metric): 1608; Packaging: Tape and Reel; Width: 0.033inch; Termination: SMD/SMT; Construction: Rectangular; Number of Terminations: 2; Length: 1.55mm; Military Standard: Not; Resistance Tolerance: 1%; Weight: 7.1E-05oz; Case Code (Imperial): 0603; Contact Plating: Tin; RoHS Compliant: Yes; Voltage Rating: 75V; Power Rating: 100mW; Lead Free: Lead Free; Technology: THICK FILM; Size Code: 0603; Radiation Hardening: No; Height: 0.45mm; Depth: 0.85mm
U1 = CMP-0786-00346-1: 300 mA, Low Quiescent Current, CMOS Linear Regulator, 2.3 to 5.5 V Vin, 3.3 V Vout, Industrial, 5-pin SOT23 (UJ-5), Reel; Manufacturer: Analog Devices; Vin (min) (V): 2.3; Supply Current IGND @ Small Load: 45uA; Vin (max) (V): 5.5; Iout max: 300mA; Preset Vout Values (V): 3.3; ComponentLink4Description: URL Link1; ComponentLink4URL: Product URL:http://www.analog.com/en/ADP122/productSearch.html; ComponentLink2URL: http://www.analog.com/static/imported-files/data_sheets/ADP122_123.pdf; PackageDescription: 5-Pin Thin Small Outline Transistor Package, Body 2.9 x 1.6 mm, Pitch 0.95 mm; ComponentLink1URL: http://www.analog.com/en/index.html; ComponentLink3URL: http:/www.analog.com/static/imported-files/packages/PKG_PDF/TSOT(UJ)/UJ_5.pdf; ComponentLink2Description: Datasheet; PartNumber: ADP122AUJZ-3.3-R7; Packing: Reel; ComponentLink1Description: Manufacturer URL; Code_JEDEC: MO-193-AB; PackageVersion: 100708-A, 10/2008; PackageReference: UJ-5; Mounting Technology: Surface Mount; DatasheetVersion: Rev. E; ComponentLink3Description: Package Specification

## Sheet DigitalInputs.SchDoc
size A3; SheetNumber: 4; SheetTotal: 11
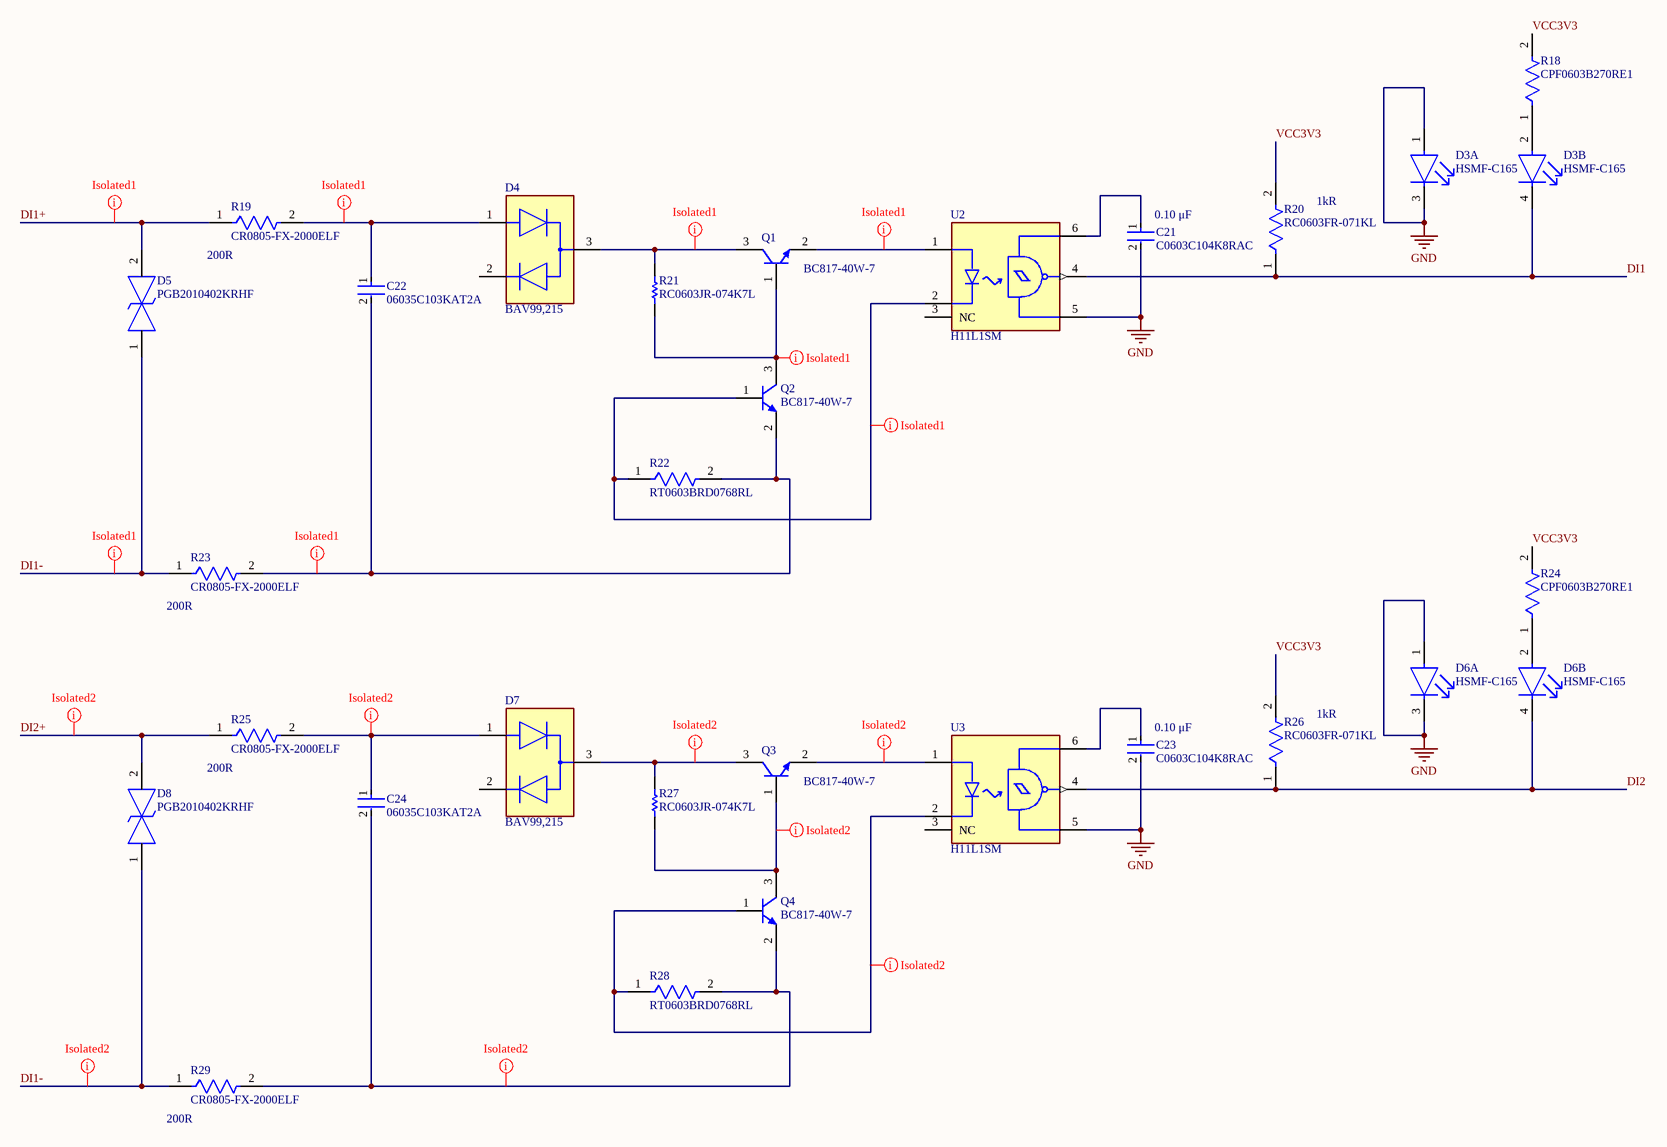
[diagram p3: DigitalInputs.SchDoc]

### Parts
C21  C0603C104K8RAC  Capacitance: 0.10 μF  [FP-C0603C-CF-MFG]
C22  06035C103KAT2A  [FP-0603-L_1_6_0_15-W_0_81-MFG]
C23  C0603C104K8RAC  Capacitance: 0.10 μF  [FP-C0603C-CF-MFG]
C24  06035C103KAT2A  [FP-0603-L_1_6_0_15-W_0_81-MFG]
D3  HSMF-C165  [FP-HSMF-C165-MFG]  (parts A,B of 2)
D4  BAV99,215  [FP-SOT23-MFG]
D5  PGB2010402KRHF  [DIONC1005X38N]
D6  HSMF-C165  [FP-HSMF-C165-MFG]  (parts A,B of 2)
D7  BAV99,215  [FP-SOT23-MFG]
D8  PGB2010402KRHF  [DIONC1005X38N]
Q1  BC817-40W-7  [DIOD-SOT323-3_V]
Q2  BC817-40W-7  [DIOD-SOT323-3_V]
Q3  BC817-40W-7  [DIOD-SOT323-3_V]
Q4  BC817-40W-7  [DIOD-SOT323-3_V]
R18  CPF0603B270RE1  [FP-CPF0603-MFG]
R19  CR0805-FX-2000ELF  Resistance: 200R  [FP-CR0805-IPC_B]
R20  RC0603FR-071KL  Resistance: 1kR  [FP-RC0603-0_55-IPC_C]
R21  RC0603JR-074K7L  [RESC1608X55X25ML10T15]
R22  RT0603BRD0768RL  [FP-RT0603-MFG]
R23  CR0805-FX-2000ELF  Resistance: 200R  [FP-CR0805-IPC_B]
R24  CPF0603B270RE1  [FP-CPF0603-MFG]
R25  CR0805-FX-2000ELF  Resistance: 200R  [FP-CR0805-IPC_B]
R26  RC0603FR-071KL  Resistance: 1kR  [FP-RC0603-0_55-IPC_C]
R27  RC0603JR-074K7L  [RESC1608X55X25ML10T15]
R28  RT0603BRD0768RL  [FP-RT0603-MFG]
R29  CR0805-FX-2000ELF  Resistance: 200R  [FP-CR0805-IPC_B]
U2  H11L1SM  [FP-646BY-MFG]
U3  H11L1SM  [FP-646BY-MFG]

### Nets
GND: C21.2 C23.2 D3.1(GREEN_A) D3.3(GREEN_C) D6.1(GREEN_A) D6.3(GREEN_C) U2.5(GND) U3.5(GND)
DI1: D3.4(RED_C) R20.1 U2.4(VO)
DI1+: D5.2 R19.1
DI1-: D5.1 D8.1 R23.1 R29.1
DI2: D6.4(RED_C) R26.1 U3.4(VO)
DI2+: D8.2 R25.1
VCC3V3: R18.2 R20.2 R24.2 R26.2
NetC21_1: C21.1 U2.6(VCC)
NetC22_1: C22.1 D4.1 R19.2
NetC22_2: C22.2 Q2.2(E) R22.2 R23.2
NetC23_1: C23.1 U3.6(VCC)
NetC24_1: C24.1 D7.1 R25.2
NetC24_2: C24.2 Q4.2(E) R28.2 R29.2
NetD3_2: D3.2(RED_A) R18.1
NetD4_3: D4.3 Q1.3(C) R21.2
NetD6_2: D6.2(RED_A) R24.1
NetD7_3: D7.3 Q3.3(C) R27.2
NetQ1_1: Q1.1(B) Q2.3(C) R21.1
NetQ1_2: Q1.2(E) U2.1(A)
NetQ2_1: Q2.1(B) R22.1 U2.2(C)
NetQ3_1: Q3.1(B) Q4.3(C) R27.1
NetQ3_2: Q3.2(E) U3.1(A)
NetQ4_1: Q4.1(B) R28.1 U3.2(C)

Not connected (* = marked no-connect by the designer): D4 2; D7 2; U2 3(NC); U3 3(NC)

### Layout directives
net class Isolated1: DI1+, DI1-, NetC22_1, NetC22_2, NetD4_3, NetQ1_1, NetQ1_2, NetQ2_1
net class Isolated2: DI1-, DI2+, NetC24_1, NetC24_2, NetD7_3, NetQ3_1, NetQ3_2, NetQ4_1

### Library data of the parts
C21 C23 = CMP-03020-006081-2: as C8 on sheet Ethernet; Automotive: Yes; Device Class L2: Capacitors; Height: 0.87mm; Temperature Range High: +125°C; Temperature Coefficient: 30ppm/°C; Temperature Range Low: -55°C; Package: C0603C-CF; Lead Free: Yes; Octopart: https://octopart.com/c0603c104k8rac-kemet-1325403; Manufacturer Part Number: C0603C104K8RAC; Temperature: -55°C to +125°C; Mouser Description: .1UF 10V 10% 0603; RoHS: TRUE; ComponentLink2URL: https://api.kemet.com/component-edge/download/datasheet/C0603C100J5GACAUTO.pdf; ComponentLink2Description: Datasheet; Temperature Characteristic: X7R; Device Class L1: Passive Components; Category: Cap; Device Class L3: Ceramic Capacitors
C22 C24 = CMP-2006-04374-2: General Purpose Ceramic Capacitor, 0603, 10nF, 10%, X7R, 15%, 50V; Insulation Resistance: 100GR; Dissipation Factor: 2.5%; Voltage: 50V; Number of Pins: 2; Min Operating Temperature: -55°C; Mount: Surface Mount; Capacitance: 10nF; Width: 0.032inch; Height: 0.9mm; Voltage Rating: 50V; Termination: SMD/SMT; Package Quantity: 1; Dielectric: X7R; Max Operating Temperature: 125°C; Contact Plating: Tin; Length: 1.6mm; Dielectric Material: Ceramic; REACH SVHC: No SVHC; Case Code (Imperial): 0603; Depth: 0.81mm; Thickness: 0.035inch; Packaging: Tape and Reel; Tolerance: 10%; Lead Free: Lead Free; Voltage Rating (DC): 50V; Radiation Hardening: No; Case/Package: 0603; Case Code (Metric): 1608
D3 D6 = CMP-2000-06424-2: LED GREEN/RED DIFFUSED 0603 SMD; Reverse Voltage: 5V; Dominant Wavelength: 621nm; Number of Elements: 2; Shape: Rectangular; Luminous Intensity: 10mcd; Forward Current: 20mA; Lens Color: White; Illumination Color: Green; Power Dissipation: 52mW; Wavelength: 572nm; Viewing Angle: 120°; Forward Voltage: 2.2V; Max Operating Temperature: 85°C; Lens Transparency: Diffused; Width: 0.8mm; Case/Package: 0603; Packaging: Tape and Reel; Case Code (Metric): 1608; Depth: 0.8mm; REACH SVHC: No SVHC; Number of LEDs: 2; Radiation Hardening: No; Lens Style: Rectangular; Color: Green; Case Code (Imperial): 0603; Min Operating Temperature: -40°C; Power Rating: 52mW; Number of Pins: 4; Number of Terminals: 4; Package Quantity: 1; Mount: Surface Mount; Height: 0.5mm; Length: 1.6mm; Lead Free: Lead Free; Test Current: 20mA
D4 D7 = CMP-14399-000006-1: DIODE ARRAY GP 100V 215MA SOT23
D5 D8 = PGB2010402KRHF: Littelfuse PGB2 Series Metal Oxide Varistor 0.07pF, Clamping 40V 0402 (1005M) Case; Geometry.Height: 0.38mm; Mouser Part Number: 576-PGB2010402KRHF; Mouser Price/Stock: https://www.mouser.co.uk/ProductDetail/Littelfuse/PGB2010402KRHF?qs=%2FlIrRR7EiyoCDVt%2F%252Bx2RKA%3D%3D; Manufacturer_Name: LITTELFUSE; Manufacturer_Part_Number: PGB2010402KRHF; Datasheet Link: https://componentsearchengine.com/Datasheets/1/PGB2010402KRHF.pdf
Q1-Q4 = CMP-2000-05934-1: NPN Small Signal Transistor, 45 V, 500 mA, -65 to 150 degC, 3-Pin SOT323, RoHS, Tape and Reel; Manufacturer: DiodesIncorporated; Configuration: Single; Collector- Emitter Voltage VCEO Max: 45V; Emitter- Base Voltage VEBO: 5V; DC Collector/Base Gain hfe Min: 250; Collector-Emitter Saturation Voltage: 0.7V; Collector- Base Voltage VCBO: 50V; Maximum DC Collector Current: 1A; Pd - Power Dissipation: 200mW; Gain Bandwidth Product fT: 100MHz; Unit Weight: 0.000282oz; Series: BC817; Datasheet Version: Rev. 5-2, 01/2014; Datasheet URL: http://www.diodes.com/_files/datasheets/ds30575.pdf; Manufacturer URL: http://www.diodes.com/; Length: 2.2mm; Mounting Style: SMD/SMT; Maximum Operating Temperature: +150C; Package Description: 3-Pin Small Outline Transistor, Body 2 x 1.25 mm, Pitch 0.65 mm; Width: 1.35mm; RoHS: True; Minimum Operating Temperature: -65C; Brand: DiodesIncorporated; Product Category: BipolarTransistors-BJT; Height: 1mm; Factory Pack Quantity: 3000; Package / Case: SOT-23; Packaging: Reel; Transistor Polarity: NPN; Mounting Technology: SurfaceMount; Package Reference: SOT323
R18 R24 = CMP-03211-003278-1: RES SMD 270Ω 0.1% 1/16W 0603; Manufacturer: TE Connectivity; Power Rating: 0.063W; Temperature Coefficient: 25ppm/°C; Voltage Rating: 50V; Composition: Thin Film; Value: 270Ω; Lead Free: Yes; Automotive: No; Category: Res; Tolerance: 0.1%; ComponentLink2Description: Datasheet; Temperature: -55°C to +155°C; Series: CPF; Manufacturer Part Number: CPF0603B270RE1; octopart_url: https://octopart.com/cpf0603b270re1-te+connectivity-9539412; Device Class L3: Chip SMD Resistors; Temperature Range Low: -55°C; ComponentLink2URL: https://www.te.com/commerce/DocumentDelivery/DDEController?Action=showdoc&DocId=Data+Sheet%7F1773200%7FM%7Fpdf%7FEnglish%7FENG_DS_1773200_M.pdf%7F3-1676481-2; Ipc Land Pattern Name: RESC15580X45; RoHS: TRUE; packaging: 1k Reel; Package: CPF0603; Device Class L2: Resistors; Device Class L1: Passive Components; Octopart: https://octopart.com/cpf0603b270re1-te+connectivity-9539412; Temperature Range High: +155°C; Resistance: 270Ω; Height: 0.55mm
R19 R23 R25 R29 = CMP-1013-00429-2: Thick Film Chip Resistors 0805 200Ω 0.125W 1% 100ppm/°C; Power Rating: 125mW; Voltage Rating: 150V; Max Operating Temperature: 155°C; Min Operating Temperature: -55°C; Case Code (Metric): 2012; Temperature Coefficient: 100ppm/°C; Case/Package: 0805; Termination: SMD/SMT; Mount: Surface Mount; Length: 2mm; Height: 0.5mm; Thickness: 508um; Military Standard: Not; Case Code (Imperial): 0805; Tolerance: 1%; Packaging: Tape and Reel; Package Quantity: 5000; Composition: Thick Film; Contact Plating: Tin; Depth: 1.25mm; Width: 1.25mm; Radiation Hardening: No
R20 R26 = CMP-1659-00009-5: RES 1K OHM 1% 1/10W 0603; Voltage Rating: 50V; Power Rating: 100mW; Temperature Coefficient: 100ppm/°C; Military Standard: Not; REACH SVHC: No SVHC; Size Code: 0603; Features: Moisture Resistant; Number of Terminations: 2; Technology: THICK FILM; Series: RC; Case Code (Metric): 1608; Resistance Tolerance: 1%; Resistor Type: Thick Film; Termination: SMD/SMT; Contact Plating: Tin; Radiation Hardening: No; Min Operating Temperature: -55°C; Max Operating Temperature: 155°C; Packaging: Tape and Reel; Max Power Dissipation: 100mW; RoHS Compliant: Yes; Height: 0.45mm; Lead Free: Lead Free; Case/Package: 0603; Length: 1.6mm; Tolerance: 1%; Case Code (Imperial): 0603; Construction: Rectangular; Depth: 0.8mm
R21 R27 = CMP-2000-05024-1: Chip Resistor, 4.7 KOhm, +/- 5%, 100 mW, -55 to 155 degC, 0603 (1608 Metric), RoHS, Tape and Reel; Manufacturer: Yageo; Resistance: 4.7kOhms; Temperature Coefficient: 100PPM/C; Power Rating: 100mW; Voltage Rating: 50V; Operating Temperature Range: -55Cto+155C; Case Code - mm: 1608; Tolerance: 5%; Product: ThickFilmResistorsGeneralPurpose; Case Code - in: 0603; Datasheet URL: http://www.yageo.com/documents/recent/PYu-RC_Group_51_RoHS_L_04.pdf; Package Reference: 603; Datasheet Version: Rev. 4, 02/2016; Package Description: 2-Pin Surface Mount Device, Body 1.6 x 0.8 mm; Manufacturer URL: http://www.yageo.com/; Series: RC; Packaging: Reel; Termination Style: SMD/SMT
R22 R28 = CMP-2000-04491-2: RES 68.0 OHM 1/10W .1% SMD 0603; Manufacturer: Yageo; Tolerance: 0.001; Temperature Coefficient: 25 ppm/°C; Resistance: 68Ω; Voltage Rating: 75V; Power Rating: 0.1W; Value: 68Ω; Automotive: No; Device Class L3: Chip SMD Resistors; Footprint Url: http://www.yageo.com/exep/pages/download/literatures/PYu-R_Mount_10.pdf; Octopart: https://octopart.com/rt0603brd0768rl-yageo-1442936; Temperature Range High: +155°C; Package: RT0603; Temperature Range Low: -55°C; Temperature: -55°C to +155°C; ComponentLink2Description: Datasheet; Digikey Description: RES 68.0 OHM 1/10W .1% SMD 0603; Manufacturer Part Number: RT0603BRD0768RL; Series: RT; Ipc Land Pattern Name: RESC16080X45; ComponentLink2URL: http://www.yageo.com/documents/recent/PYu-RT_1-to-0.01_RoHS_L_9.pdf; Category: Res; Lead Free: Yes; RoHS: TRUE; Device Class L1: Passive Components; Mouser Description: Thin Film Resistors 1/10W 68 ohm .1% 25ppm; Device Class L2: Resistors; Composition: Thin Film; Height: 0.55mm
U2 U3 = CMP-2000-06383-2: OPTOISO 4.17KV OPN COLL 6SMD; Manufacturer: ON Semiconductor; Max Junction Temp: +125°C; Max Supply Voltage: 15V; Turn On Delay Time: 1us; Isolation Voltage: 4170Vrms; Min Supply Voltage: 3V; Forward Voltage: 1.2V; Power Dissipation: 250mW; Forward Current: 10mA; Standoff Height: 0.38mm; Turn Off Delay Time: 1.2us; Device Class L3: unset; Package: 646BY; Device Class L1: Optoelectronics; Temperature: -40°C to +85°C; Lead Free: Yes; ComponentLink2Description: Datasheet; RoHS: TRUE; Footprint Url: https://www.onsemi.com/pub/Collateral/646BY.PDF; Temperature Range High: +85°C; Octopart: https://octopart.com/h11l1sm-on+semiconductor-84328916; Device Class L2: Optocouplers; Height: 4.8mm; Category: IC; Temperature Range Low: -40°C; Reverse Voltage: 3V; ComponentLink2URL: https://www.onsemi.com/pub/Collateral/H11L3M-D.PDF; Manufacturer Part Number: H11L1SM; Automotive: No; Digikey Description: OPTOISO 4.17KV OPN COLL 6SMD

## Sheet LED_DRIVER.SchDoc
size A3; SheetNumber: 5; SheetTotal: 7
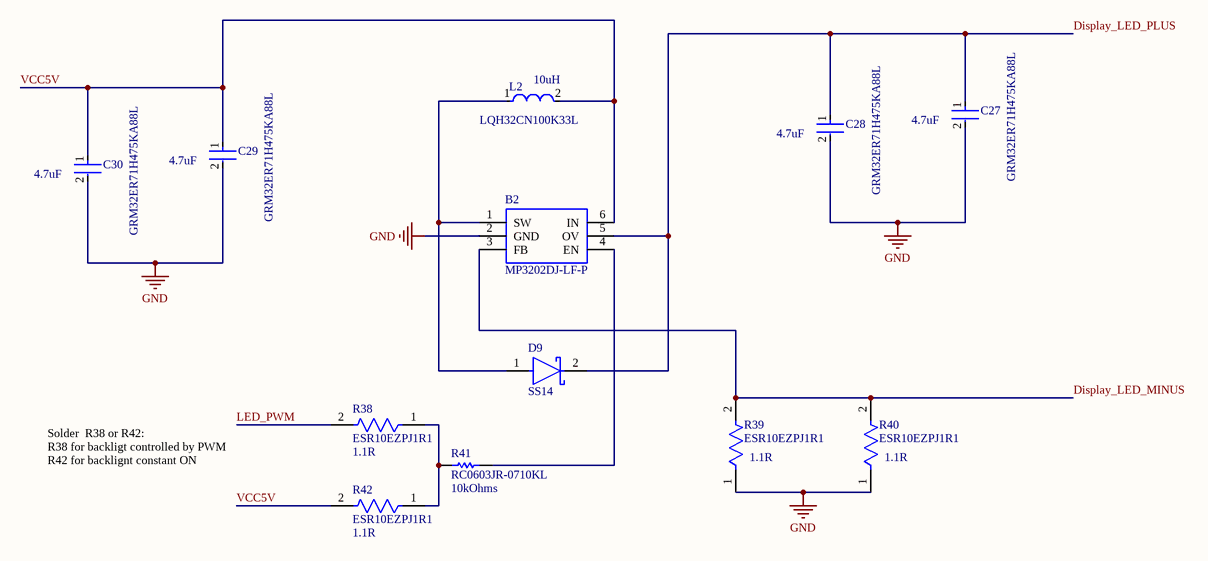
[diagram p4: LED_DRIVER.SchDoc]

### Parts
B2  MP3202DJ-LF-P  [SOT95P280X100-6N]
C27  GRM32ER71H475KA88L  value 4.7uF  [FP-GRM32-MFG]
C28  GRM32ER71H475KA88L  value 4.7uF  [FP-GRM32-MFG]
C29  GRM32ER71H475KA88L  value 4.7uF  [FP-GRM32-MFG]
C30  GRM32ER71H475KA88L  value 4.7uF  [FP-GRM32-MFG]
D9  SS14  [FP-403AE-MFG]
L2  LQH32CN100K33L  Inductance: 10uH  [FP-LQH32CH_33-A2_3_2_8-MFG]
R38  ESR10EZPJ1R1  Resistance: 1.1R  [FP-ESR10-IPC_A]
R39  ESR10EZPJ1R1  Resistance: 1.1R  [FP-ESR10-IPC_A]
R40  ESR10EZPJ1R1  Resistance: 1.1R  [FP-ESR10-IPC_A]
R41  RC0603JR-0710KL  Resistance: 10kOhms  [RESC1608X55X25ML10T15]
R42  ESR10EZPJ1R1  Resistance: 1.1R  [FP-ESR10-IPC_A]

### Nets
GND: B2.2(GND) C27.2 C28.2 C29.2 C30.2 R39.1 R40.1
Display_LED_MINUS: B2.3(FB) R39.2 R40.2
Display_LED_PLUS: B2.5(OV) C27.1 C28.1 D9.2(C)
LED_PWM: R38.2
VCC5V: B2.6(IN) C29.1 C30.1 L2.2 R42.2
NetB2_1: B2.1(SW) D9.1(A) L2.1
NetB2_4: B2.4(EN) R41.1
NetR38_1: R38.1 R41.2 R42.1

### Notes on the sheet
- Solder  R38 or R42:
  R38 for backligt controlled by PWM
  R42 for backlignt constant ON

### Library data of the parts
B2 = MP3202DJ-LF-P: Monolithic Power Systems (MPS) MP3202DJ-LF-P LED Driver IC, 2.5  6 V 6-Pin; Geometry.Height: 1mm; Mouser Part Number: 946-MP3202DJLFP; Mouser Price/Stock: https://www.mouser.co.uk/ProductDetail/Monolithic-Power-Systems-MPS/MP3202DJ-LF-P?qs=rC7bBWoQAAnkWXT%252BwQ2sJQ%3D%3D; Manufacturer_Name: Monolithic Power Systems (MPS); Manufacturer_Part_Number: MP3202DJ-LF-P; Datasheet Link: http://www.monolithicpower.com/DesktopModules/DocumentManage/API/Document/GetDocument?id=1215
C27-C30 = CMP-1038-02162-3: as C15 on sheet Power; Lead Free: Yes; ComponentLink2Description: Datasheet; Capacitance: 4.7uF; Digikey Description: CAP CER 4.7UF 50V X7R 1210; Category: Cap; Automotive: No; ComponentLink2URL: https://search.murata.co.jp/Ceramy/image/img/A01X/G101/ENG/GRM32ER71H475KA88-01A.pdf; Package: GRM32; Device Class L2: Capacitors; Voltage Rating: 50V; Device Class L1: Passive Components; Mouser Description: Capacitor Capacitance tolerance: ±10% Ceramic type: X7R Construction form: 1210 Capacitance: 4.7 µF Rated voltage: 50...; Octopart: https://octopart.com/grm32er71h475ka88l-murata-196576; Temperature: -55°C to +125°C; Temperature Range Low: -55°C; Height: 2.7mm; Manufacturer Part Number: GRM32ER71H475KA88L; Temperature Characteristic: X7R; Temperature Range High: +125°C; RoHS: TRUE; Device Class L3: Ceramic Capacitors
D9 = CMP-2000-04943-2: DIODE SCHOTTKY 40V 1A SMA; Manufacturer: ON Semiconductor; Peak Reverse Current: 0.2mA; Max Junction Temp: +125°C; Standoff Height: 0.05mm; Max Surge Forward Current: 40A; Mouser Description: Schottky Diodes & Rectifiers SMA 40V 1.0A; RoHS: TRUE; Lead Free: Yes; Manufacturer Part Number: SS14; Device Class L3: Schottky Diodes; Category: Diode; Automotive: No; Digikey Description: DIODE SCHOTTKY 40V 1A SMA; ComponentLink2Description: Datasheet; Device Class L2: Diodes; Height: 2.5mm; Temperature Range High: +125°C; ComponentLink2URL: https://www.onsemi.com/pub/Collateral/SS19-D.PDF; Device Class L1: Discrete Semiconductors; Package: 403AE; Octopart: https://octopart.com/ss14-on+semiconductor-29205033; Max Repetitive Reverse Voltage: 40V; Temperature Range Low: -65°C; Forward Current: 1A; Temperature: -65°C to +125°C
L2 = CMP-06042-000202-2: Wire Wound Ferrite Inductor for Power Lines 10μH ±10% 0.39Ω 450mA 1210; Shielding: Unshielded; DC Resistance (DCR): 34mR; Self Resonant Frequency: 26MHz; Test Frequency: 1MHz; Q Factor: 35; Current: 1.25A; Parameter 1: Inductance; Number of Pins: 2; Inductance Tolerance: 10%; Max Operating Temperature: 85°C; Tolerance: 10%; Case Code (Imperial): 1210; Series: LQH32C_33; Height: 2mm; DC Current: 450mA; Min Operating Temperature: -25°C; Current Rating: 450mA; Case Code (Metric): 3225; Core Material: Ferrite; Width: 2.5mm; Length: 3.2mm; REACH SVHC: No SVHC; Radiation Hardening: No; Depth: 2.7mm; Termination: SMD/SMT; Rated Current-Max: 450mA; Inductor Type: Wirewound; Package Quantity: 1; Packaging: Tape and Reel; Max DC Current: 450mA; Lead Free: Lead Free; Military Standard: Not; Mount: Surface Mount; Weight: 0.002116oz; Case/Package: 1210
R38-R40 R42 = CMP-08839-028421-1: 1.1Ω ±5% 0.4W 0805 Anti-Surge Chip Resistor AEC-Q200; Max Power Dissipation: 400mW; Temperature Coefficient: 200ppm/°C; Packaging: Tape and Reel; Max Operating Temperature: 155°C; Case Code (Imperial): 0805; Case/Package: 0805; Package Quantity: 1; Width: 0.049inch; Length: 0.079inch; Resistor Type: Thick Film; Case Code (Metric): 2012; Number of Terminations: 2; RoHS Compliant: Yes; Min Operating Temperature: -55°C; Tolerance: 5%; Series: ESR; Features: Automotive AEC-Q200; Height: 0.026inch
R41 = CMP-2000-05022-1: as R1 on sheet Sheet1; Package Reference: 603; Series: RC; Case Code - mm: 1608; Packaging: Reel; Datasheet URL: http://www.farnell.com/datasheets/443971.pdf; Datasheet Version: Rev. 4, 04/2009; Operating Temperature Range: -55Cto+155C; Product: ThickFilmResistorsGeneralPurpose; Package Description: 2-Pin Surface Mount Device, Body 1.6 x 0.8 mm; Manufacturer URL: http://www.yageo.com/; Case Code - in: 0603; Tolerance: 5%; Termination Style: SMD/SMT